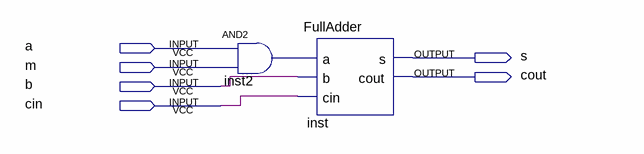
[diagram p0: schematic sheet]
// Quartus schematic FullAdderAnd.bdf as structural Verilog: 2 symbols, 6 pins
module FullAdderAnd (
  input  a,
  input  m,
  input  b,
  input  cin,
  output s,
  output cout
);

  wire inst2_out;

  and inst2 (inst2_out, a, m);
  FullAdder inst (.a(inst2_out), .b(b), .cin(cin), .s(s), .cout(cout));
endmodule
